# Altium project ife18_TS_BMS_Master.PrjPcb
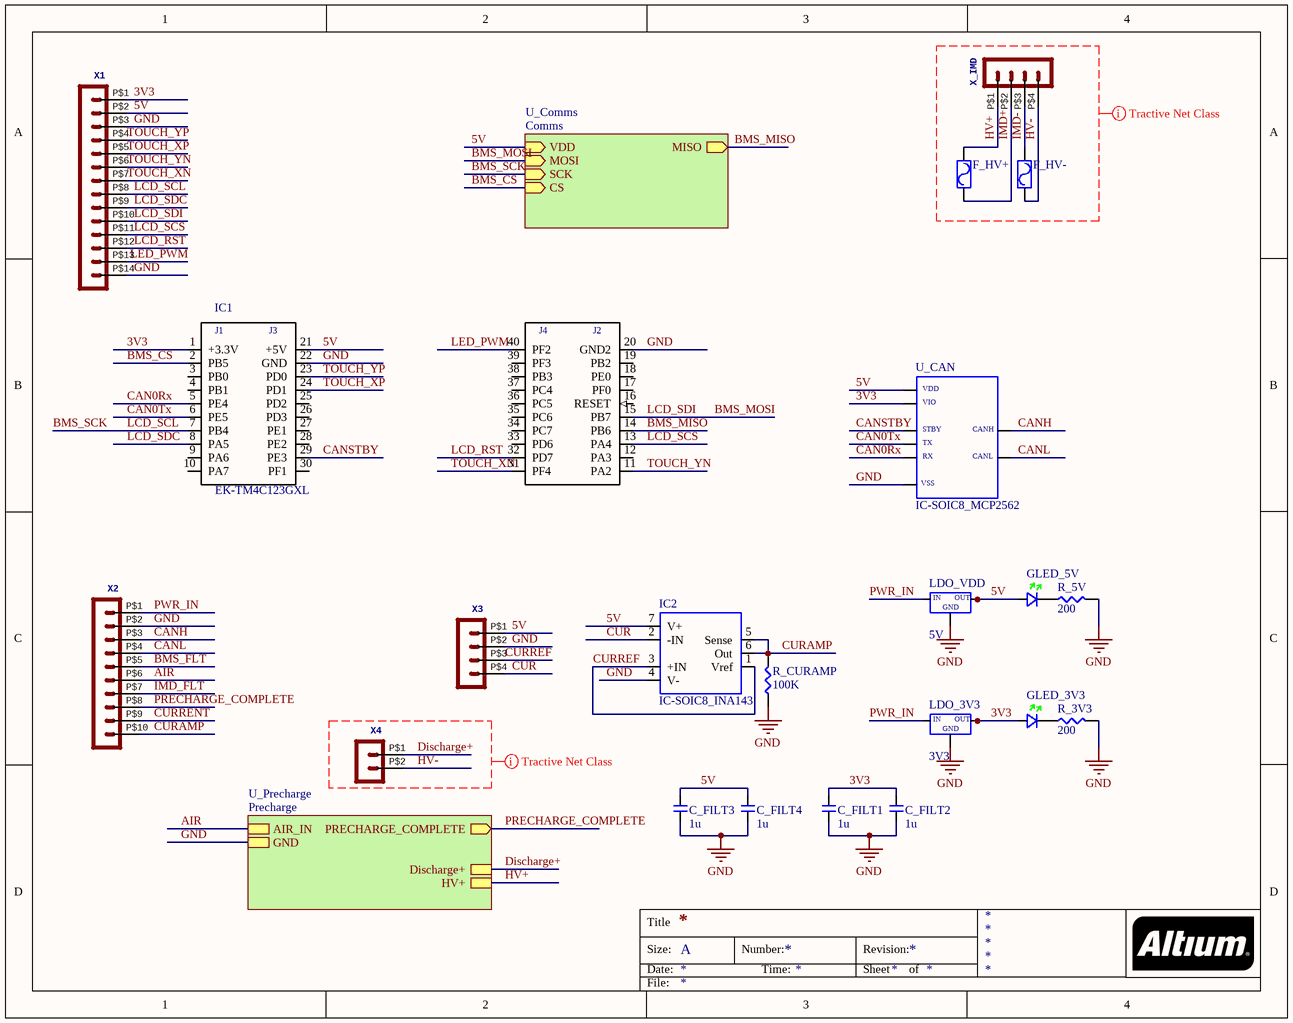
[diagram p0: ife18_TS_BMS_Master.SchDoc]
3 sheets, 49 parts. Net scope: hierarchical (ports join the sheet entries above them; power ports are global).
Board file: ife18_TS_BMS_Master.PcbDoc
Sheets:
  ife18_TS_BMS_Master.SchDoc
    U_Comms = Comms.SchDoc
    U_Precharge = Precharge.SchDoc

## Sheet ife18_TS_BMS_Master.SchDoc
size A

### Parts
C_FILT1  1u  [CAP-0603]
C_FILT2  1u  [CAP-0603]
C_FILT3  1u  [CAP-0603]
C_FILT4  1u  [CAP-0603]
F_HV+  (no value)  [FUSE3AG_354101]
F_HV-  (no value)  [FUSE3AG_354101]
GLED_3V3  (no value)  [LEDGREEN-0603]
GLED_5V  (no value)  [LEDGREEN-0603]
IC1  EK-TM4C123GXL  [TM4C123LAUNCHPAD]
IC2  IC-SOIC8_INA143  [SOIC8]
LDO_3V3  3V3  [SOT223]
LDO_VDD  5V  [SOT223]
R_3V3  200  [RES-0603]
R_5V  200  [RES-0603]
R_CURAMP  100K  [RES-0603]
U_CAN  IC-SOIC8_MCP2562  [SOIC8]
X1  Molex - Micro-Fit 3.0 Series connector,  3.00mm (0.118") pitch header, 14 positions.  [43045-1418]  (value not drawn)
X2  Molex - Micro-Fit 3.0 Series connector,  3.00mm (0.118") pitch header, 10 positions.  [43045-1018]  (value not drawn)
X3  Molex - Micro-Fit 3.0 Series connector,  3.00mm (0.118") pitch header, 4 positions.  [43650-0424]  (value not drawn)
X4  Molex - Micro-Fit 3.0 Series connector,  3.00mm (0.118") pitch header, 2 positions.  [43650-0224]  (value not drawn)
X_IMD  (no value)  [43650-0424]

### Sub-sheets
U_Comms = Comms: VDD (in), MOSI (in), MISO (out), SCK (in), CS (in)
U_Precharge = Precharge: PRECHARGE_COMPLETE (out), AIR_IN, GND, Discharge+, HV+

### Nets
AIR: X2.P$6 ; sheet U_Precharge/AIR_IN
GND: C_FILT1.1 C_FILT2.1 C_FILT3.1 C_FILT4.1 IC1.20(GND2) IC1.22(GND) IC2.4(V-) LDO_3V3.1 LDO_VDD.1 R_3V3.2 R_5V.2 R_CURAMP.1 U_CAN.2 X1.P$3 X1.P$14 X2.P$2 X3.P$2 ; sheet U_Precharge/GND
3V3: C_FILT1.2 C_FILT2.2 GLED_3V3.A IC1.1(+3.3V) LDO_3V3.2 LDO_3V3.4 U_CAN.5 X1.P$1
5V: C_FILT3.2 C_FILT4.2 GLED_5V.A IC1.21(+5V) IC2.7(V+) LDO_VDD.2 LDO_VDD.4 U_CAN.3 X1.P$2 X3.P$1 ; sheet U_Comms/VDD
BMS_CS: IC1.2(PB5) ; sheet U_Comms/CS
BMS_FLT: X2.P$5
BMS_MISO: IC1.14(PB6) ; sheet U_Comms/MISO
BMS_MOSI: IC1.15(PB7) X1.P$10 ; sheet U_Comms/MOSI  [also labelled LCD_SDI]
BMS_SCK: IC1.7(PB4) X1.P$8 ; sheet U_Comms/SCK  [also labelled LCD_SCL]
CAN0Rx: IC1.5(PE4) U_CAN.4
CAN0Tx: IC1.6(PE5) U_CAN.1
CANH: U_CAN.7 X2.P$3
CANL: U_CAN.6 X2.P$4
CANSTBY: IC1.29(PE3) U_CAN.8
CUR: IC2.2(-IN) X3.P$4
CURAMP: IC2.5(Sense) IC2.6(Out) R_CURAMP.2 X2.P$10
CURREF: IC2.1(Vref) IC2.3(+IN) X3.P$3
CURRENT: X2.P$9
Discharge+: X4.P$1 ; sheet U_Precharge/Discharge+
HV+: F_HV+.2 X_IMD.P$1 ; sheet U_Precharge/HV+
HV-: F_HV-.1 X4.P$2 X_IMD.P$4
IMD+: F_HV+.1 X_IMD.P$2
IMD-: F_HV-.2 X_IMD.P$3
IMD_FLT: X2.P$7
LCD_RST: IC1.32(PD7) X1.P$12
LCD_SCS: IC1.13(PA4) X1.P$11
LCD_SDC: IC1.8(PA5) X1.P$9
LED_PWM: IC1.40(PF2) X1.P$13
PRECHARGE_COMPLETE: X2.P$8 ; sheet U_Precharge/PRECHARGE_COMPLETE
PWR_IN: LDO_3V3.3 LDO_VDD.3 X2.P$1
TOUCH_XN: IC1.31(PF4) X1.P$7
TOUCH_XP: IC1.24(PD1) X1.P$5
TOUCH_YN: IC1.11(PA2) X1.P$6
TOUCH_YP: IC1.23(PD0) X1.P$4
NetGLED_3V3_K: GLED_3V3.K R_3V3.1
NetGLED_5V_K: GLED_5V.K R_5V.1

Not connected (* = marked no-connect by the designer): IC1 3(PB0) 4(PB1) 9(PA6) 10(PA7) 12(PA3) 16(RESET) 17(PF0) 18(PE0) 19(PB2) 25(PD2) 26(PD3) 27(PE1) 28(PE2) 30(PF1) 33(PD6) 34(PC7) 35(PC6) 36(PC5) 37(PC4) 38(PB3) 39(PF3)

### Layout directives
net class Tractive: Discharge+, HV+, HV-, IMD+, IMD-

### Notes on the sheet
- Title
- Size:
- Date:
- A
- Number:
- Time:
- Revision:
- Sheet
- of
- File:
- (in symbol EK-TM4C123GXL) J1; J3; J4; J2
- (in symbol IC-SOIC8_MCP2562) VDD; VIO; STBY; CANH; TX; RX; CANL; VSS
- (in symbol LDO-SOT223_SPX1117) IN; OUT; GND

### Library data of the parts
C_FILT1-C_FILT4 = CAP-0603
F_HV+ F_HV- = FUSE-354101
GLED_3V3 GLED_5V = LEDGREEN-0603
IC1 = EK-TM4C123GXL: Evaluation Kit For ARM Cortex-M4F-based Microcontrollers; MF: Texas Instruments; MP: EK-TM4C123GXL; Package: None; Price: None; SnapEDA_Link: https://www.snapeda.com/parts/EK-TM4C123GXL/Texas%20Instruments/view-part/?ref=snap; Availability: Unavailable; Value: *
LDO_3V3 LDO_VDD = LDO-SOT223_SPX1117
R_3V3 R_5V R_CURAMP = RES-0603
X1 = POS14_MF43045-1418: GateName_1: G$1; SymbolName_1: HEADER_POS14; DeviceSetName: HEADER_POS14_?; DeviceName: 43045-1418; LibraryName: MOLEX Micro-Fit; Package: 43045-1418
X2 = POS10_MF43045-1018: GateName_1: G$1; SymbolName_1: HEADER_POS10; DeviceSetName: HEADER_POS10_?; DeviceName: 43045-1018; LibraryName: MOLEX Micro-Fit; Package: 43045-1018
X3 X_IMD = POS4_MF43650-0424: GateName_1: G$1; SymbolName_1: HEADER_POS4; DeviceSetName: HEADER_POS4_?; DeviceName: 43650-0424; LibraryName: MOLEX Micro-Fit; Package: 43650-0424
X4 = POS2_MF43650-0224: GateName_1: G$1; SymbolName_1: HEADER_POS2; DeviceSetName: HEADER_POS2_?; DeviceName: 43650-0224; LibraryName: MOLEX Micro-Fit; Package: 43650-0224

## Sheet Comms.SchDoc
size A
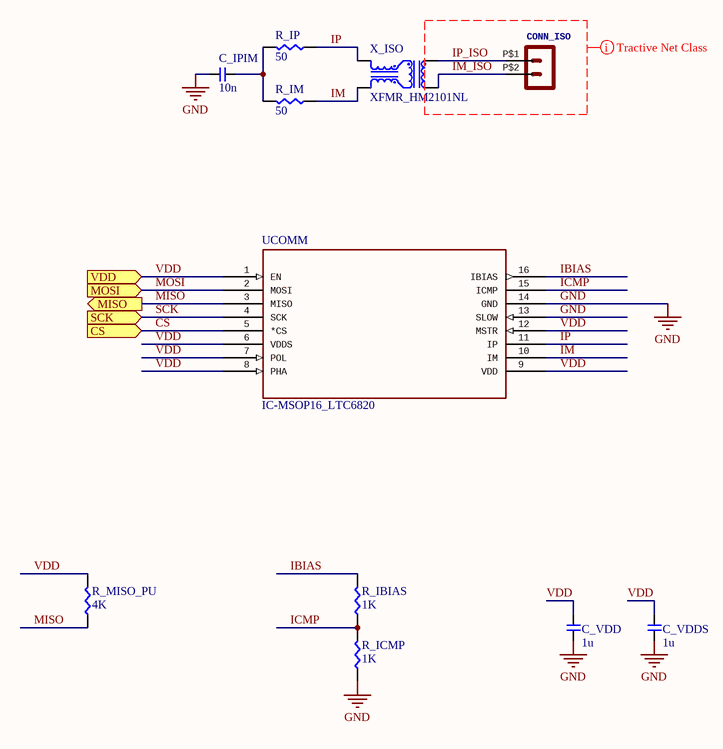
[diagram p1: Comms.SchDoc]

### Parts
(Parts that share a designator on the sheet are numbered #1, #2 ... from top to bottom, then left to right.)
C_IPIM  10n  [CAP-0603]
C_VDD#1  1u  [CAP-0603]
C_VDDS  1u  [CAP-0603]
CONN_ISO  (no value)  [43650-0224]
R_IBIAS  1K  [RES-0603]
R_ICMP  1K  [RES-0603]
R_IM  50  [RES-0603]
R_IP  50  [RES-0603]
R_MISO_PU  4K  [RES-0603]
UCOMM  IC-MSOP16_LTC6820  [MSOP16]
X_ISO  XFMR_HM2101NL  [HM2101]

### Ports
CS (in), MISO (out), MOSI (in), SCK (in), VDD (in)

### Nets
GND: C_IPIM.2 C_VDD#1.1 C_VDDS.1 R_ICMP.1 UCOMM.13(SLOW) UCOMM.14(GND)
CS: UCOMM.5(*CS) ; port CS  [project net BMS_CS]
IBIAS: R_IBIAS.2 UCOMM.16(IBIAS)
ICMP: R_IBIAS.1 R_ICMP.2 UCOMM.15(ICMP)
IM: R_IM.1 UCOMM.10(IM) X_ISO.6
IM_ISO: CONN_ISO.P$2 X_ISO.1
IP: R_IP.1 UCOMM.11(IP) X_ISO.4
IP_ISO: CONN_ISO.P$1 X_ISO.3
MISO: R_MISO_PU.1 UCOMM.3(MISO) ; port MISO  [project net BMS_MISO]
MOSI: UCOMM.2(MOSI) ; port MOSI  [project net BMS_MOSI]
SCK: UCOMM.4(SCK) ; port SCK  [project net BMS_SCK]
VDD: C_VDD#1.2 C_VDDS.2 R_MISO_PU.2 UCOMM.1(EN) UCOMM.6(VDDS) UCOMM.7(POL) UCOMM.8(PHA) UCOMM.9(VDD) UCOMM.12(MSTR) ; port VDD  [project net 5V]
NetC_IPIM_1: C_IPIM.1 R_IM.2 R_IP.2

### Layout directives
net class Tractive: IM_ISO, IP_ISO

### Library data of the parts
C_IPIM C_VDD#1 C_VDDS = CAP-0603
CONN_ISO = POS2_43650-0224: GateName_1: G$1; SymbolName_1: HEADER_POS2; DeviceSetName: HEADER_POS2_?; DeviceName: 43650-0224; LibraryName: MOLEX Micro-Fit; Package: 43650-0224
R_IBIAS R_ICMP R_IM R_IP R_MISO_PU = RES-0603

## Sheet Precharge.SchDoc: Precharge
size 241 x 127 mm; Date: 1/4/2019 10:42:01 PM; SheetNumber: 1; GateName_1: G$1; SymbolName_1: LETTER_L; LibraryName: frames; DeviceSetName: LETTER_L; GateName_2: G$2; SymbolName_2: DOCFIELD
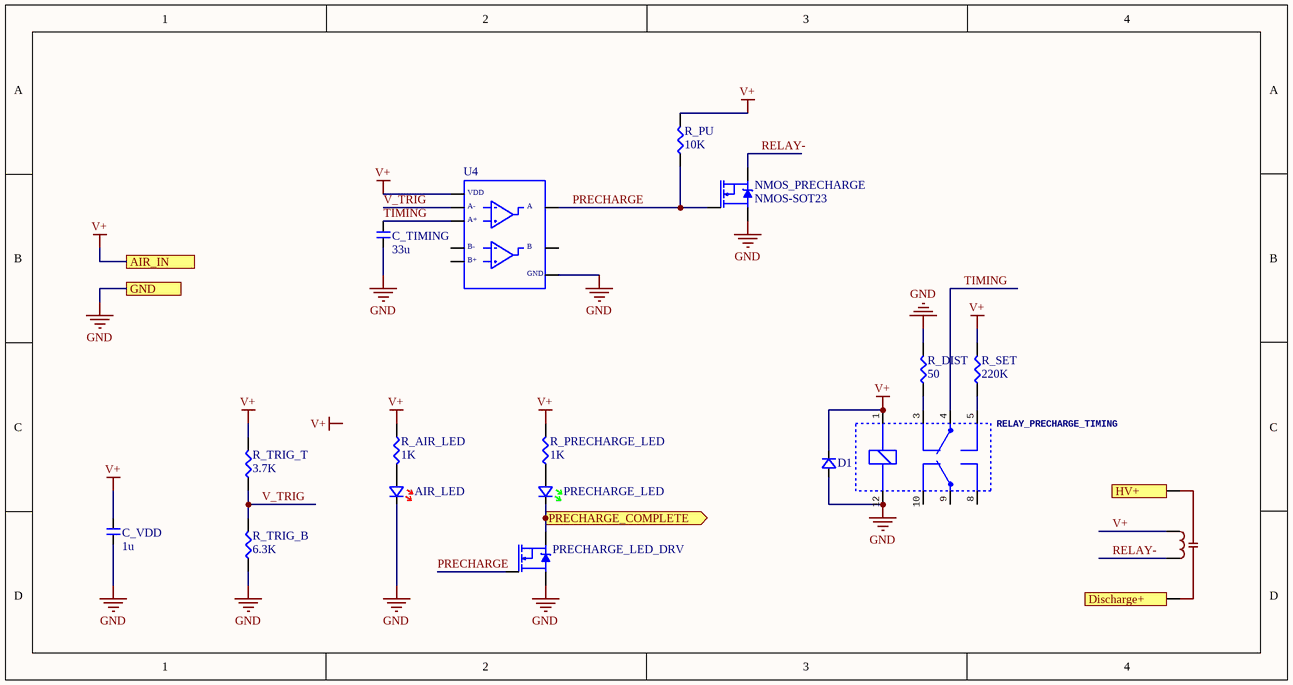
[diagram p2: Precharge.SchDoc]

### Parts
(Parts that share a designator on the sheet are numbered #1, #2 ... from top to bottom, then left to right.)
AIR_LED  (no value)  [LEDRED-0603]
C_TIMING  33u  [CAP-0603]
C_VDD#2  1u  [CAP-0603]
D1  (no value)  [DO41-10]
NMOS_PRECHARGE  NMOS-SOT23  [SOT23]
PRECHARGE_LED  (no value)  [LEDGREEN-0603]
PRECHARGE_LED_DRV  (no value)  [SOT23]
R_AIR_LED  1K  [RES-0603]
R_DIST  50  [AXIAL0.5]
R_PRECHARGE_LED  1K  [RES-0603]
R_PU  10K  [RES-0603]
R_SET  220K  [AXIAL0.5]
R_TRIG_B  6.3K  [RES-0603]
R_TRIG_T  3.7K  [RES-0603]
RELAY_PRECHARGE  COTO9104  [9104-SIP4]  (value not drawn)
RELAY_PRECHARGE_TIMING  (no value)  [RELAY-DPDT_EC2]
U4  (no value)  [SOIC8]

### Ports
AIR_IN, Discharge+, GND, HV+, PRECHARGE_COMPLETE (out)

### Nets
GND: AIR_LED.K C_TIMING.1 C_VDD#2.1 D1.A NMOS_PRECHARGE.2(S) PRECHARGE_LED_DRV.2(S) R_DIST.2 R_TRIG_B.1 RELAY_PRECHARGE_TIMING.12 U4.4 ; port GND
V+: C_VDD#2.2 D1.K R_AIR_LED.1 R_PRECHARGE_LED.2 R_PU.2 R_SET.2 R_TRIG_T.2 RELAY_PRECHARGE.3 RELAY_PRECHARGE_TIMING.1 U4.8 ; port AIR_IN  [project net AIR]
Discharge+: RELAY_PRECHARGE.7 ; port Discharge+
HV+: RELAY_PRECHARGE.1 ; port HV+
PRECHARGE: NMOS_PRECHARGE.1(G) PRECHARGE_LED_DRV.1(G) R_PU.1 U4.1
PRECHARGE_COMPLETE: PRECHARGE_LED.K PRECHARGE_LED_DRV.3(D) ; port PRECHARGE_COMPLETE
RELAY-: NMOS_PRECHARGE.3(D) RELAY_PRECHARGE.5
TIMING: C_TIMING.2 RELAY_PRECHARGE_TIMING.4 U4.3
V_TRIG: R_TRIG_B.2 R_TRIG_T.1 U4.2
NetAIR_LED_A: AIR_LED.A R_AIR_LED.2
NetPRECHARGE_LED_A: PRECHARGE_LED.A R_PRECHARGE_LED.1
NetR_DIST_1: R_DIST.1 RELAY_PRECHARGE_TIMING.3
NetR_SET_1: R_SET.1 RELAY_PRECHARGE_TIMING.5

Not connected (* = marked no-connect by the designer): RELAY_PRECHARGE_TIMING 8 9 10; U4 5 6 7

### Notes on the sheet
- Labels drawn without touching a wire or pin: V+
- Title
- Size:
- Date:
- A
- Number:
- Time:
- Revision:
- Sheet
- of
- File:
- (in symbol IC-SOIC8_LM393) VDD; A-; A; A+; B-; B; B+; GND

### Library data of the parts
AIR_LED = LEDRED-0603
C_TIMING C_VDD#2 = CAP-0603
D1 = DIODE-DO41-10
PRECHARGE_LED = LEDGREEN-0603
PRECHARGE_LED_DRV = NMOS-SOT23
R_AIR_LED R_PRECHARGE_LED R_PU R_TRIG_B R_TRIG_T = RES-0603
R_DIST R_SET = RES-AXIAL0.5
RELAY_PRECHARGE = COTO9104: GateName_1: G$1; SymbolName_1: SPST_REED; LibraryName: Discharge_Components_Altium_Export; DeviceSetName: COTO9104; Package: 9104-SIP4
RELAY_PRECHARGE_TIMING = RELAY_EC2: GateName_1: G$1; SymbolName_1: MONOSTABLERELAY; DeviceSetName: EC2; LibraryName: KEMET; Package: DPDT_2.54
U4 = IC-SOIC8_LM393

## Nets that join several sheets
AIR: ife18_TS_BMS_Master (X2.P$6), Precharge (10 pins)
GND: ife18_TS_BMS_Master (17 pins), Comms (6 pins), Precharge (10 pins)
5V: ife18_TS_BMS_Master (10 pins), Comms (9 pins)
BMS_CS: ife18_TS_BMS_Master (IC1.2), Comms (UCOMM.5)
BMS_MISO: ife18_TS_BMS_Master (IC1.14), Comms (R_MISO_PU.1 UCOMM.3)
BMS_MOSI: ife18_TS_BMS_Master (IC1.15 X1.P$10), Comms (UCOMM.2)
BMS_SCK: ife18_TS_BMS_Master (IC1.7 X1.P$8), Comms (UCOMM.4)
Discharge+: ife18_TS_BMS_Master (X4.P$1), Precharge (RELAY_PRECHARGE.7)
HV+: ife18_TS_BMS_Master (F_HV+.2 X_IMD.P$1), Precharge (RELAY_PRECHARGE.1)
PRECHARGE_COMPLETE: ife18_TS_BMS_Master (X2.P$8), Precharge (PRECHARGE_LED.K PRECHARGE_LED_DRV.3)